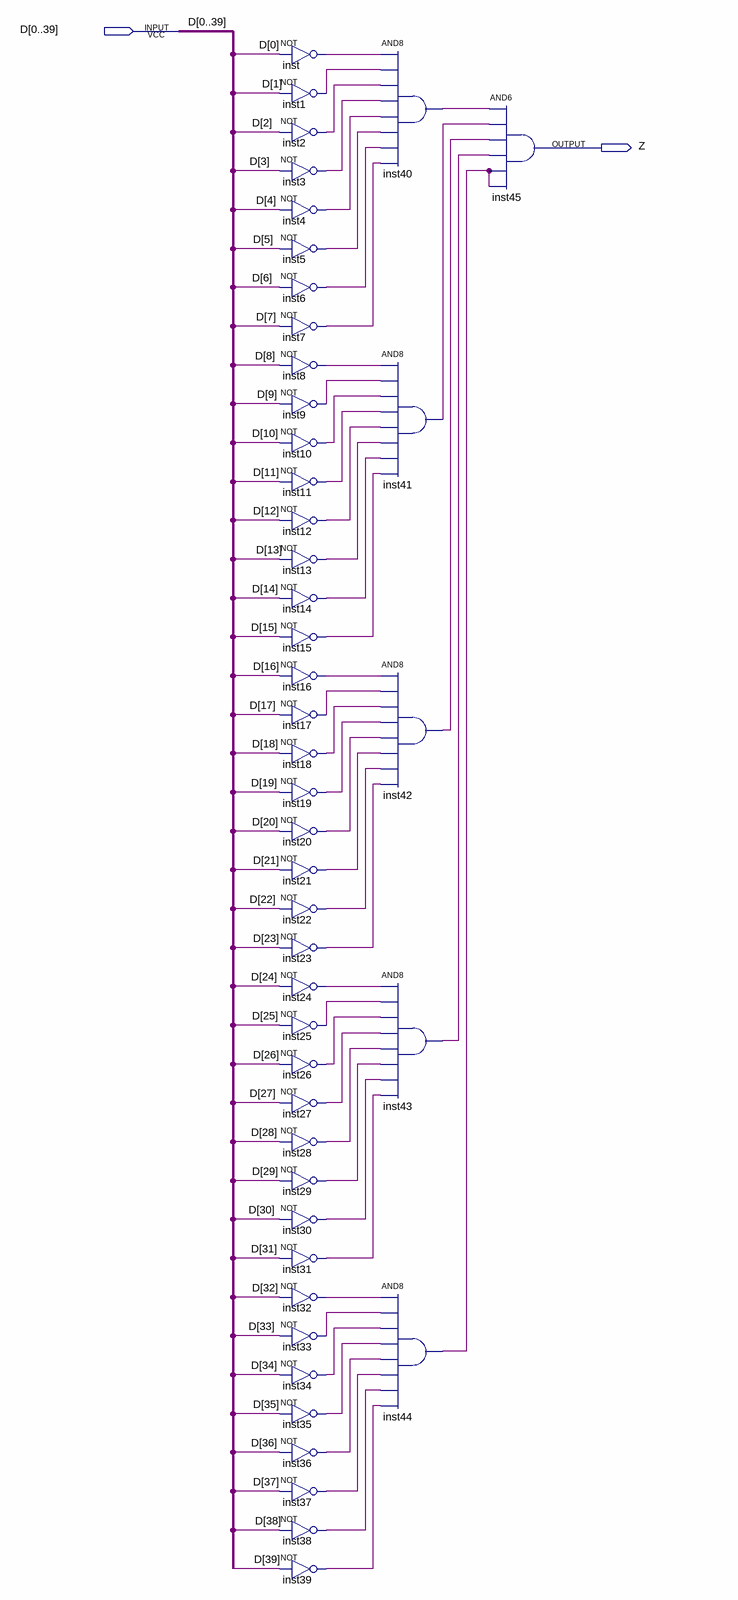
[diagram p0: schematic sheet]
// Quartus schematic Z.bdf as structural Verilog: 46 symbols, 2 pins
module Z (
  input  [0:39] D,
  output Z
);

  wire inst1_out, inst2_out, inst3_out, inst4_out, inst5_out, inst6_out, inst7_out, inst8_out, inst9_out,
       inst10_out, inst11_out, inst12_out, inst13_out, inst14_out, inst15_out, inst16_out, inst17_out,
       inst18_out, inst19_out, inst20_out, inst21_out, inst22_out, inst23_out, inst24_out, inst25_out,
       inst26_out, inst27_out, inst28_out, inst29_out, inst30_out, inst31_out, inst32_out, inst33_out,
       inst34_out, inst35_out, inst36_out, inst37_out, inst38_out, inst39_out, inst40_out, inst41_out,
       inst42_out, inst43_out, inst44_out, inst_out;

  not inst (inst_out, D[0]);
  not inst1 (inst1_out, D[1]);
  not inst2 (inst2_out, D[2]);
  not inst3 (inst3_out, D[3]);
  not inst4 (inst4_out, D[4]);
  not inst5 (inst5_out, D[5]);
  not inst6 (inst6_out, D[6]);
  not inst7 (inst7_out, D[7]);
  not inst8 (inst8_out, D[8]);
  not inst9 (inst9_out, D[9]);
  not inst10 (inst10_out, D[10]);
  not inst11 (inst11_out, D[11]);
  not inst12 (inst12_out, D[12]);
  not inst13 (inst13_out, D[13]);
  not inst14 (inst14_out, D[14]);
  not inst15 (inst15_out, D[15]);
  not inst16 (inst16_out, D[16]);
  not inst17 (inst17_out, D[17]);
  not inst18 (inst18_out, D[18]);
  not inst19 (inst19_out, D[19]);
  not inst20 (inst20_out, D[20]);
  not inst21 (inst21_out, D[21]);
  not inst22 (inst22_out, D[22]);
  not inst23 (inst23_out, D[23]);
  not inst24 (inst24_out, D[24]);
  not inst25 (inst25_out, D[25]);
  not inst26 (inst26_out, D[26]);
  not inst27 (inst27_out, D[27]);
  not inst28 (inst28_out, D[28]);
  not inst29 (inst29_out, D[29]);
  not inst30 (inst30_out, D[30]);
  not inst31 (inst31_out, D[31]);
  not inst32 (inst32_out, D[32]);
  not inst33 (inst33_out, D[33]);
  not inst34 (inst34_out, D[34]);
  not inst35 (inst35_out, D[35]);
  not inst36 (inst36_out, D[36]);
  not inst37 (inst37_out, D[37]);
  not inst38 (inst38_out, D[38]);
  not inst39 (inst39_out, D[39]);
  and inst40 (inst40_out, inst_out, inst1_out, inst2_out, inst3_out, inst4_out, inst5_out, inst6_out, inst7_out);
  and inst41 (inst41_out, inst8_out, inst9_out, inst10_out, inst11_out, inst12_out, inst13_out, inst14_out, inst15_out);
  and inst42 (inst42_out, inst16_out, inst17_out, inst18_out, inst19_out, inst20_out, inst21_out, inst22_out, inst23_out);
  and inst43 (inst43_out, inst24_out, inst25_out, inst26_out, inst27_out, inst28_out, inst29_out, inst30_out, inst31_out);
  and inst44 (inst44_out, inst32_out, inst33_out, inst34_out, inst35_out, inst36_out, inst37_out, inst38_out, inst39_out);
  and inst45 (Z, inst40_out, inst41_out, inst42_out, inst43_out, inst44_out, inst44_out);
endmodule
